# EAGLE schematic aux board (EAGLE 6.3)
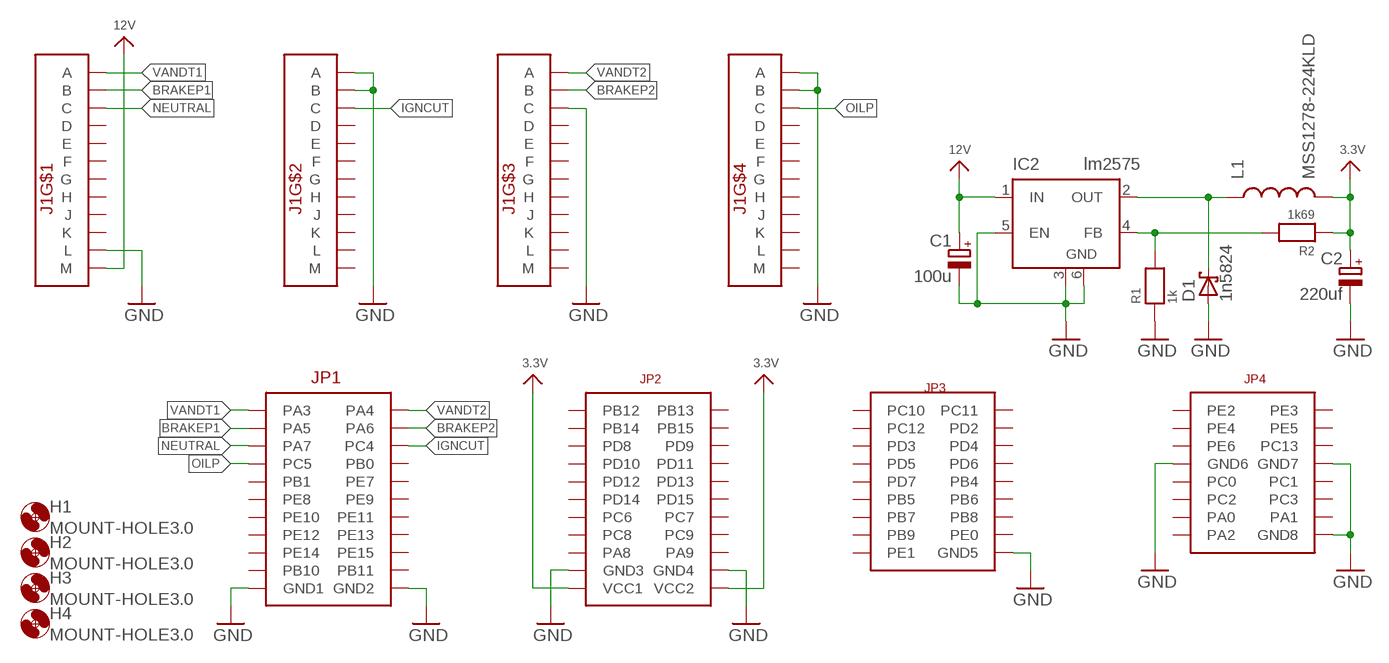
[diagram p0: schematic, sheet 1]

## Parts
C1  100u  CPOL-EUE2.5-7  [E2,5-7]
C2  220uf  CPOL-EUE3.5-8  [E3,5-8]
D1  1n5824  SCHOTTKY-DIODEF126Z12  [F126Z12]
H1  MOUNT-HOLE3.0  [3,0]
H2  MOUNT-HOLE3.0  [3,0]
H3  MOUNT-HOLE3.0  [3,0]
H4  MOUNT-HOLE3.0  [3,0]
IC2  lm2575  LM2596S  [TO263-5]
J1  AUTOCONNECTOR  [AUTOCONNECTOR]
L1  MSS1278-224KLD  INDUCTORPWR  [CDRH125]
R1  1k  RESISTOR_0603  [_0603]
R2  1k69  RESISTOR_0603  [_0603]
U$1  CPU-BOARD  [CPU-BOARD-JP1]

## Nets
3.3V: C2.+ L1.2 R2.1 U$1.P$43(VCC1) U$1.P$44(VCC2)
12V: C1.+ IC2.1(IN) J1.M1(M)
BRAKEP1: J1.B1(B) U$1.P$3(PA5)
BRAKEP2: J1.B3(B) U$1.P$4(PA6)
GND: C1.- C2.- D1.A IC2.3(GND) IC2.5(EN) IC2.6(GND) J1.A2(A) J1.A4(A) J1.B2(B) J1.B4(B) J1.C3(C) J1.L1(L) R1.1 U$1.P$21(GND1) U$1.P$22(GND2) U$1.P$41(GND3) U$1.P$42(GND4) U$1.P$62(GND5) U$1.P$69(GND6) U$1.P$70(GND7) U$1.P$78(GND8)
IGNCUT: J1.C2(C) U$1.P$6(PC4)
N$1: IC2.4(FB) R1.2 R2.2
N$2: D1.C IC2.2(OUT) L1.1
NEUTRAL: J1.C1(C) U$1.P$5(PA7)
OILP: J1.C4(C) U$1.P$7(PC5)
VANDT1: J1.A1(A) U$1.P$1(PA3)
VANDT2: J1.A3(A) U$1.P$2(PA4)
Unconnected: J1.D1(D) J1.D2(D) J1.D3(D) J1.D4(D) J1.E1(E) J1.E2(E) J1.E3(E) J1.E4(E) J1.F1(F) J1.F2(F) J1.F3(F) J1.F4(F) J1.G1(G) J1.G2(G) J1.G3(G) J1.G4(G) J1.H1(H) J1.H2(H) J1.H3(H) J1.H4(H) J1.J1(J) J1.J2(J) J1.J3(J) J1.J4(J) J1.K1(K) J1.K2(K) J1.K3(K) J1.K4(K) J1.L2(L) J1.L3(L) J1.L4(L) J1.M2(M) J1.M3(M) J1.M4(M) U$1.P$8(PB0) U$1.P$9(PB1) U$1.P$10(PE7) U$1.P$11(PE8) U$1.P$12(PE9) U$1.P$13(PE10) U$1.P$14(PE11) U$1.P$15(PE12) U$1.P$16(PE13) U$1.P$17(PE14) U$1.P$18(PE15) U$1.P$19(PB10) U$1.P$20(PB11) U$1.P$23(PB12) U$1.P$24(PB13) U$1.P$25(PB14) U$1.P$26(PB15) U$1.P$27(PD8) U$1.P$28(PD9) U$1.P$29(PD10) U$1.P$30(PD11) U$1.P$31(PD12) U$1.P$32(PD13) U$1.P$33(PD14) U$1.P$34(PD15) U$1.P$35(PC6) U$1.P$36(PC7) U$1.P$37(PC8) U$1.P$38(PC9) U$1.P$39(PA8) U$1.P$40(PA9) U$1.P$45(PC10) U$1.P$46(PC11) U$1.P$47(PC12) U$1.P$48(PD2) U$1.P$49(PD3) U$1.P$50(PD4) U$1.P$51(PD5) U$1.P$52(PD6) U$1.P$53(PD7) U$1.P$54(PB4) U$1.P$55(PB5) U$1.P$56(PB6) U$1.P$57(PB7) U$1.P$58(PB8) U$1.P$59(PB9) U$1.P$60(PE0) U$1.P$61(PE1) U$1.P$63(PE2) U$1.P$64(PE3) U$1.P$65(PE4) U$1.P$66(PE5) U$1.P$67(PE6) U$1.P$68(PC13) U$1.P$71(PC0) U$1.P$72(PC1) U$1.P$73(PC2) U$1.P$74(PC3) U$1.P$75(PA0) U$1.P$76(PA1) U$1.P$77(PA2)

## Library data of the parts
C1 C2 = rcl:CPOL-EU: POLARIZED CAPACITOR, European symbol
D1 = diode:SCHOTTKY-DIODE: Schottky Diode
H1-H4 = holes:MOUNT-HOLE: MOUNTING HOLE with drill center marker
IC2 = linear:LM2596S: STEP-DOWN VOLTAGE REGULATOR
J1 = unicorn_v2:AUTOCONNECTOR
L1 = SparkFun-Passives:INDUCTOR: Inductors Basic Inductor/Choke - 0603 and 1206. Footprints are not proven and vary greatly between part numbers. INDUCTOR POWER 3.3UH 4.0A SMD 0.197" L x 0.197" W x 0.177" H (5.00mm x 5.00mm x 4.50mm)
R1 R2 = microbuilder:RESISTOR: Resistors 0402 - 0402 Surface Mount Package 22 Ohm 1% 1/16W [Digikey: 311-22.0LRTR-ND] 33 Ohm 5% 1/16W 1.0K 5% 1/16W 1.5K 5% 1/16W 2.0K 1% 1/16W 10.0K 1% 1/16W [Digikey: 311-10.0KLRTR-ND] 10.0K 5% 1/16W [Digikey: RMCF0402JT10K0TR-ND] 12.1K 1% 1/16W [Digikey: 311-22.0LRTR-ND] 100.0K 5% 1/16W 0603 - 0603 Surface Mount Package 0 Ohm 1/10 Watt 1% Resistor 15 Ohm 1/10 Watt 1% Resistor 33 Ohm 1/10 Watt 1% Resistor 49.9 Ohm 1/10 Watt 1% Resistor 100 Ohm 1/10 Watt 1% Resistor 150 Ohm 1/10 Watt 1% Resistor 240 Ohm 1/10 Watt 1% Resistor 390 Ohm 1/10 Watt 1% Resistor 560 Ohm 1/10 Watt 1% Resistor 680 Ohm 1/10 Watt 1% Resistor 750 Ohm 1/10 Watt 1% Resistor 1.0K Ohm 1/10 Watt 1% Resistor 1.5K Ohm 1/10 Watt 1% Resistor 2.0K Ohm 1/10 Watt 1% Resistor 2.2K Ohm 1/10 Watt 1% Resistor 3.3K Ohm 1/10 Watt 1% Resistor 4.7K Ohm 1/10 Watt 1% Resistor 10.0K Ohm 1/10 Watt 1% Resistor 12.0K Ohm 1/10 Watt 1% Resistor 12.1K Ohm 1/10 Watt 1% Resistor 20.0K Ohm 1/10 Watt 1% Resistor 33.0K Ohm 1/10 Watt 1% Resistor 100.0K Ohm 1/10 Watt 1% Resistor 0805 - 0805 Surface Mount Package 0 Ohm 1/8 Watt 1% Resistor 33 Ohm 1/8 Watt 1% Resistor 100 Ohm 1/8 Watt 1% Resistor 150 Ohm 1/8 Watt 1% Resistor 200 Ohm 1/8 Watt 1% Resistor 240 Ohm 1/8 Watt 1% Resistor 330 Ohm 1/8 Watt 1% Resistor 390 Ohm 1/8 Watt 1% Resistor 470 Ohm 1/8 Watt 1% Resistor 1.0K Ohm 1/8 Watt 1% Resistor 1.5K Ohm 1/8 Watt 1% Resistor 2.0K Ohm 1/8 Watt 1% Resistor 4.7K Ohm 1/8 Watt 1% Resistor 5.1K Ohm 1/8 Watt 1% Resistor 5.6K Ohm 1/8 Watt 1% Resistor 10.0K Ohm 1/8 Watt 1% Resistor 22.0K Ohm 1/8 Watt 1% Resistor 33.0K Ohm 1/8 Watt 1% Resistor 100K Ohm 1/8 Watt 1% Resistor 1206 - 1206 Surface Mount Package 2012 - 2010 Surface Mount Package 0.11 Ohm 1/2 Watt 1% Resistor - Digikey: RHM.11UCT-ND
U$1 = unicorn_v2:CPU-BOARD